# Altium schematic sheet CH32L103K8U6-R0.SchDoc
size 304 x 254 mm
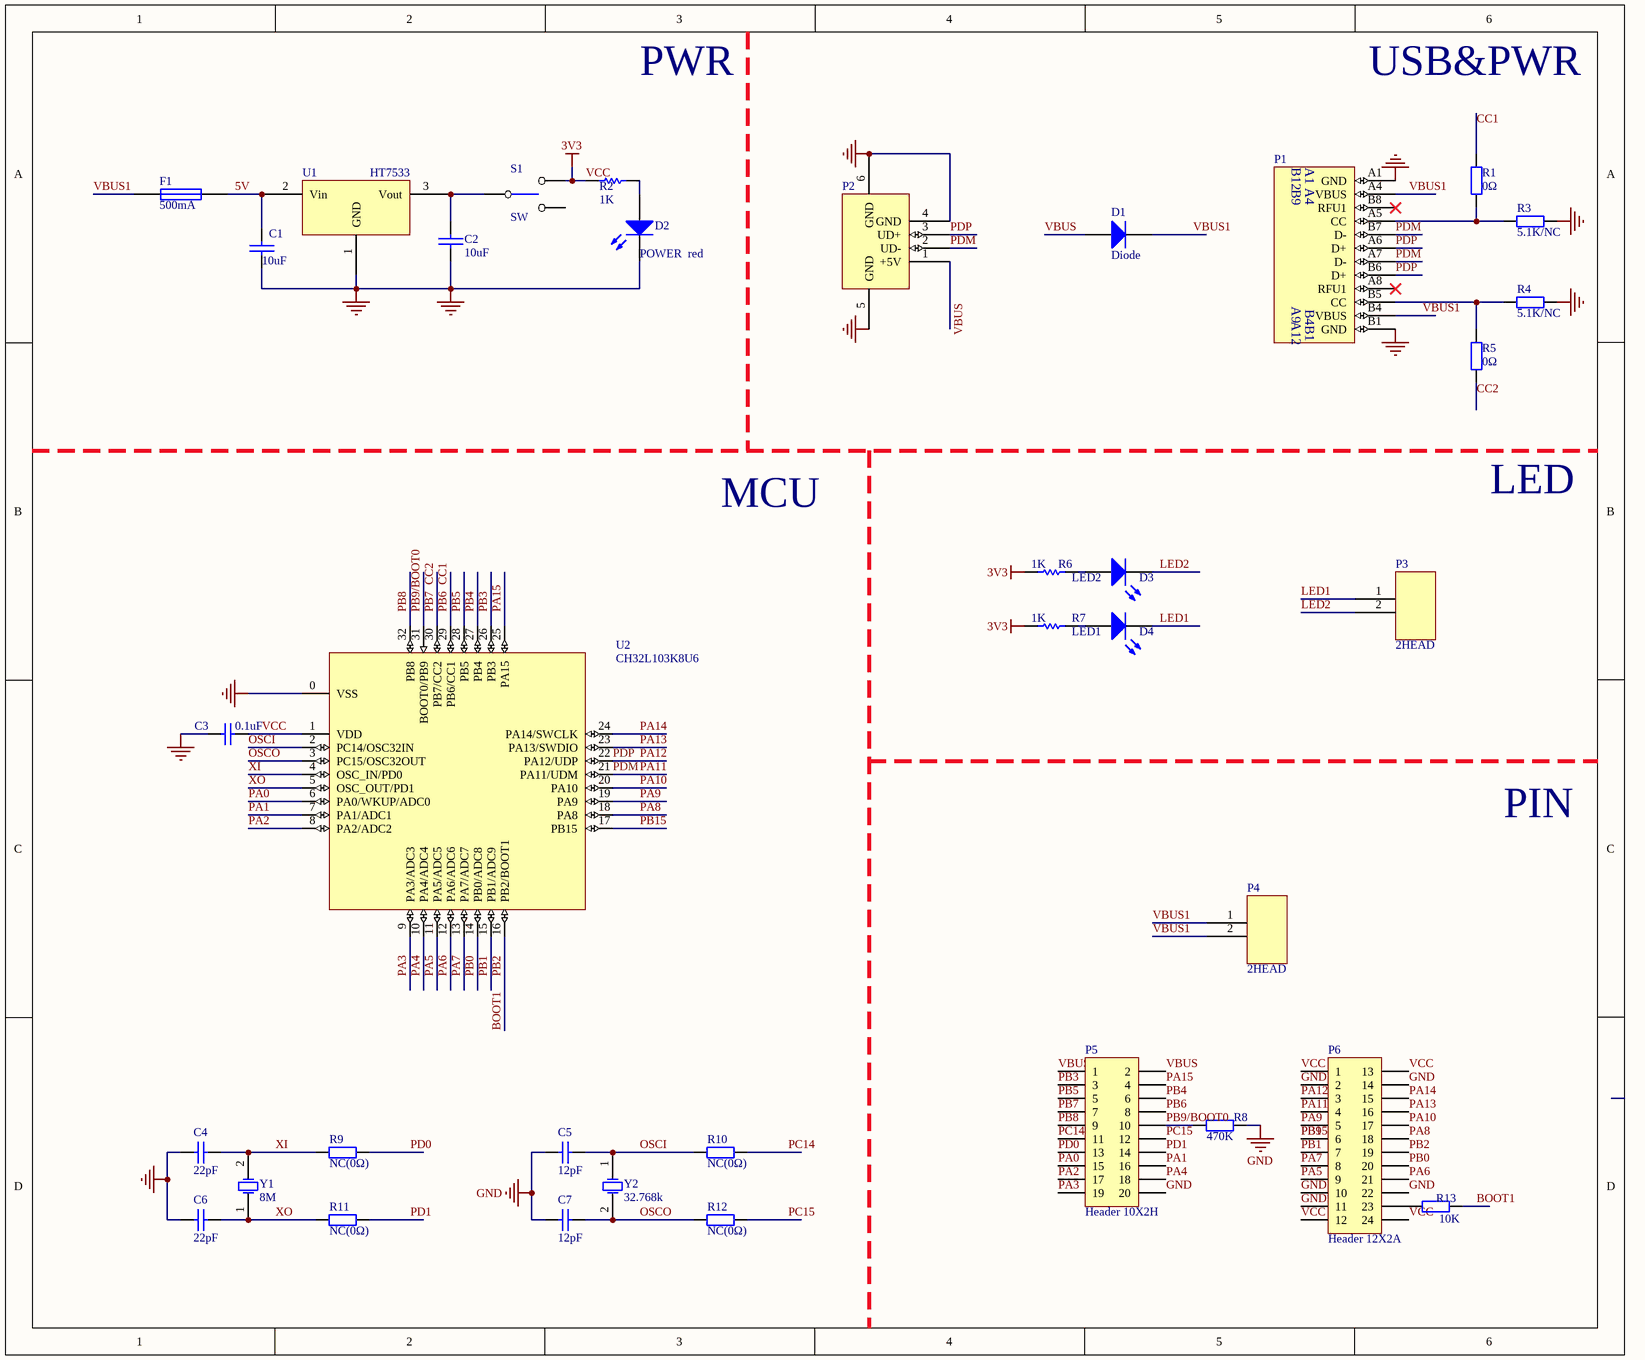
[diagram p0: CH32L103K8U6-R0.SchDoc]

## Parts
C1  10uF  [0603_C]
C2  10uF  [0603_C]
C3  0.1uF  [0603_C]
C4  22pF  [0603_C]
C5  12pF  [0603]
C6  22pF  [0603_C]
C7  12pF  [0603]
D1  Diode  [SOD-123]
D2  POWER  red  [0603+]
D3  LED2  [0603+]
D4  LED1  [0603+]
F1  500mA  [0603]
P1  TYPE-C  [TYPE-C-Receptacle-2.0]  (value not drawn)
P2  USB_A  [USBAF]  (value not drawn)
P3  2HEAD  [SIP2-2.54mm]
P4  2HEAD  [SIP2-2.54mm]
P5  Header 10X2H  [HDR2X10H]
P6  Header 12X2A  [HDR2X12_CEN]
R1  0Ω  [0603]
R2  1K  [0603]
R3  5.1K/NC  [0603]
R4  5.1K/NC  [0603]
R5  0Ω  [0603]
R6  1K  [0603]
R7  1K  [0603]
R8  470K  [0603]
R9  NC(0Ω)  [0603]
R10  NC(0Ω)  [0603]
R11  NC(0Ω)  [0603]
R12  NC(0Ω)  [0603]
R13  10K  [0603]
S1  SW  [SW1]
U1  HT7533  [SOT-89]
U2  CH32L103K8U6  [QFN32_4X4]
Y1  8M  [XT_AT49]
Y2  32.768k  [FC-135]

## Nets
GND: C1.2 C2.2 C3.2 C4.1 C5.2 C6.1 C7.2 D2.2(K) P1.A1(GND) P1.B1(GND) P2.4(GND) P2.5(GND) P2.6(GND) P5.20 P6.2 P6.10 P6.11 P6.14 P6.22 R3.2 R4.2 R8.2 U1.1(GND) U2.0(VSS)
VCC: C3.1 P6.1 P6.12 P6.13 P6.24 R2.2 R6.1 R7.1 S1.3 U2.1(VDD)  [also labelled 3V3]
5V: C1.1 F1.2 U1.2(Vin)
BOOT1: P6.19 R13.2 U2.16(PB2/BOOT1)  [also labelled PB2]
CC1: P5.8 R1.2 U2.29(PB6/CC1)  [also labelled PB6]
CC2: P5.7 R5.1 U2.30(PB7/CC2)  [also labelled PB7]
LED1: D4.2(K) P3.1
LED2: D3.2(K) P3.2
OSCI: C5.1 R10.2 U2.2(PC14/OSC32IN) Y2.1(OSC1)
OSCO: C7.1 R12.2 U2.3(PC15/OSC32OUT) Y2.2(OSC2)
PA0: P5.15 U2.6(PA0/WKUP/ADC0)
PA1: P5.16 U2.7(PA1/ADC1)
PA2: P5.17 U2.8(PA2/ADC2)
PA3: P5.19 U2.9(PA3/ADC3)
PA4: P5.18 U2.10(PA4/ADC4)
PA5: P6.9 U2.11(PA5/ADC5)
PA6: P6.21 U2.12(PA6/ADC6)
PA7: P6.8 U2.13(PA7/ADC7)
PA8: P6.18 U2.18(PA8)
PA9: P6.5 U2.19(PA9)
PA10: P6.17 U2.20(PA10)
PA11: P1.A7(D-) P1.B7(D-) P2.2(UD-) P6.4 U2.21(PA11/UDM)  [also labelled PDM]
PA12: P1.A6(D+) P1.B6(D+) P2.3(UD+) P6.3 U2.22(PA12/UDP)  [also labelled PDP]
PA13: P6.16 U2.23(PA13/SWDIO)
PA14: P6.15 U2.24(PA14/SWCLK)
PA15: P5.4 U2.25(PA15)
PB0: P6.20 U2.14(PB0/ADC8)
PB1: P6.7 U2.15(PB1/ADC9)
PB3: P5.3 U2.26(PB3)
PB4: P5.6 U2.27(PB4)
PB5: P5.5 U2.28(PB5)
PB8: P5.9 U2.32(PB8)
PB9/BOOT0: P5.10 R8.1 U2.31(BOOT0/PB9)
PB15: P6.6 U2.17(PB15)  [also labelled PB9]
PC14: P5.11 R10.1
PC15: P5.12 R12.1
PD0: P5.13 R9.1
PD1: P5.14 R11.1
VBUS: D1.1(A) P2.1(+5V) P5.1 P5.2
VBUS1: D1.2(K) F1.1 P1.A4(VBUS) P1.B4(VBUS) P4.1 P4.2
XI: C4.2 R9.2 U2.4(OSC_IN/PD0) Y1.2(OSC2)
XO: C6.2 R11.2 U2.5(OSC_OUT/PD1) Y1.1(OSC1)
NetC2_1: C2.1 S1.1 U1.3(Vout)
NetD2_1: D2.1(A) R2.1
NetD3_1: D3.1(A) R6.2
NetD4_1: D4.1(A) R7.2
NetP1_A5: P1.A5(CC) R1.1 R3.1
NetP1_B5: P1.B5(CC) R4.1 R5.2
NetP6_23: P6.23 R13.1

Not connected (* = marked no-connect by the designer): P1 A8(RFU1)* B8(RFU1)*; S1 2

## Notes on the sheet
- PWR
- USB&PWR
- LED
- MCU
- PIN
- (in symbol TYPE-C1) B12; B9; A9; A12

## Library data of the parts
C1 C2 = CAP: Capacitor
C3-C7 = Cap: Capacitor; Published: 8-Jun-2000; LatestRevisionDate: 17-Jul-2002; LatestRevisionNote: Re-released for DXP Platform.; PackageReference: RAD-0.3; Publisher: Altium Limited
D1 = Diode: Default Diode; Published: 8-Jun-2000; LatestRevisionDate: 17-Jul-2002; LatestRevisionNote: Re-released for DXP Platform.; PackageVersion: Sep-1996; PackageReference: SMC; Publisher: Altium Limited; Code_JEDEC: DO-214-AB
D2-D4 = LED0: Typical INFRARED GaAs LED; Published: 8-Jun-2000; LatestRevisionDate: 08-Jul-2005; LatestRevisionNote: Mech Layer 1 removed.; PackageReference: LED-0; Publisher: Altium Limited
F1 = FUSE1: Fuse
P1 = TYPE-C1
P2 = USB: USB Port
P5 = Header 10X2H: Header, 10-Pin, Dual row, Right Angle; LatestRevisionDate: 17-Jul-2002; LatestRevisionNote: Re-released for DXP Platform.; Publisher: Altium Limited
P6 = Header 12X2A: Header, 12-Pin, Dual row; LatestRevisionDate: 17-Jul-2002; LatestRevisionNote: Re-released for DXP Platform.; Publisher: Altium Limited
R1 R3-R5 R8-R13 = Res2: Resistor
  R13: Published: 8-Jun-2000; LatestRevisionDate: 17-Jul-2002; LatestRevisionNote: Re-released for DXP Platform.; PackageReference: AXIAL-0.4; Publisher: Altium Limited; Value: 10K
R2 R6 R7 = Res Semi: Semiconductor Resistor
U1 = 1117-3.3V
U2 = CH32L103K8U6: RISC-V LMD-MCU, 96MHz, USB, Type-C/PD-5K1, CAN, OPA, lower power
Y1 Y2 = XTAL: Crystal Oscillator; Published: 8-Jun-2000; LatestRevisionDate: 17-Jul-2002; LatestRevisionNote: Re-released for DXP Platform.; PackageReference: R38; Publisher: Altium Limited